# EasyEDA schematic SCH_ESP32_PCB_2026-04-29.json
TITLE: Sheet_1; REV: 1.0; Date: 2026-04-29; Sheet: 1/1; Drawn By: nare.manukian222; Company: Your Company
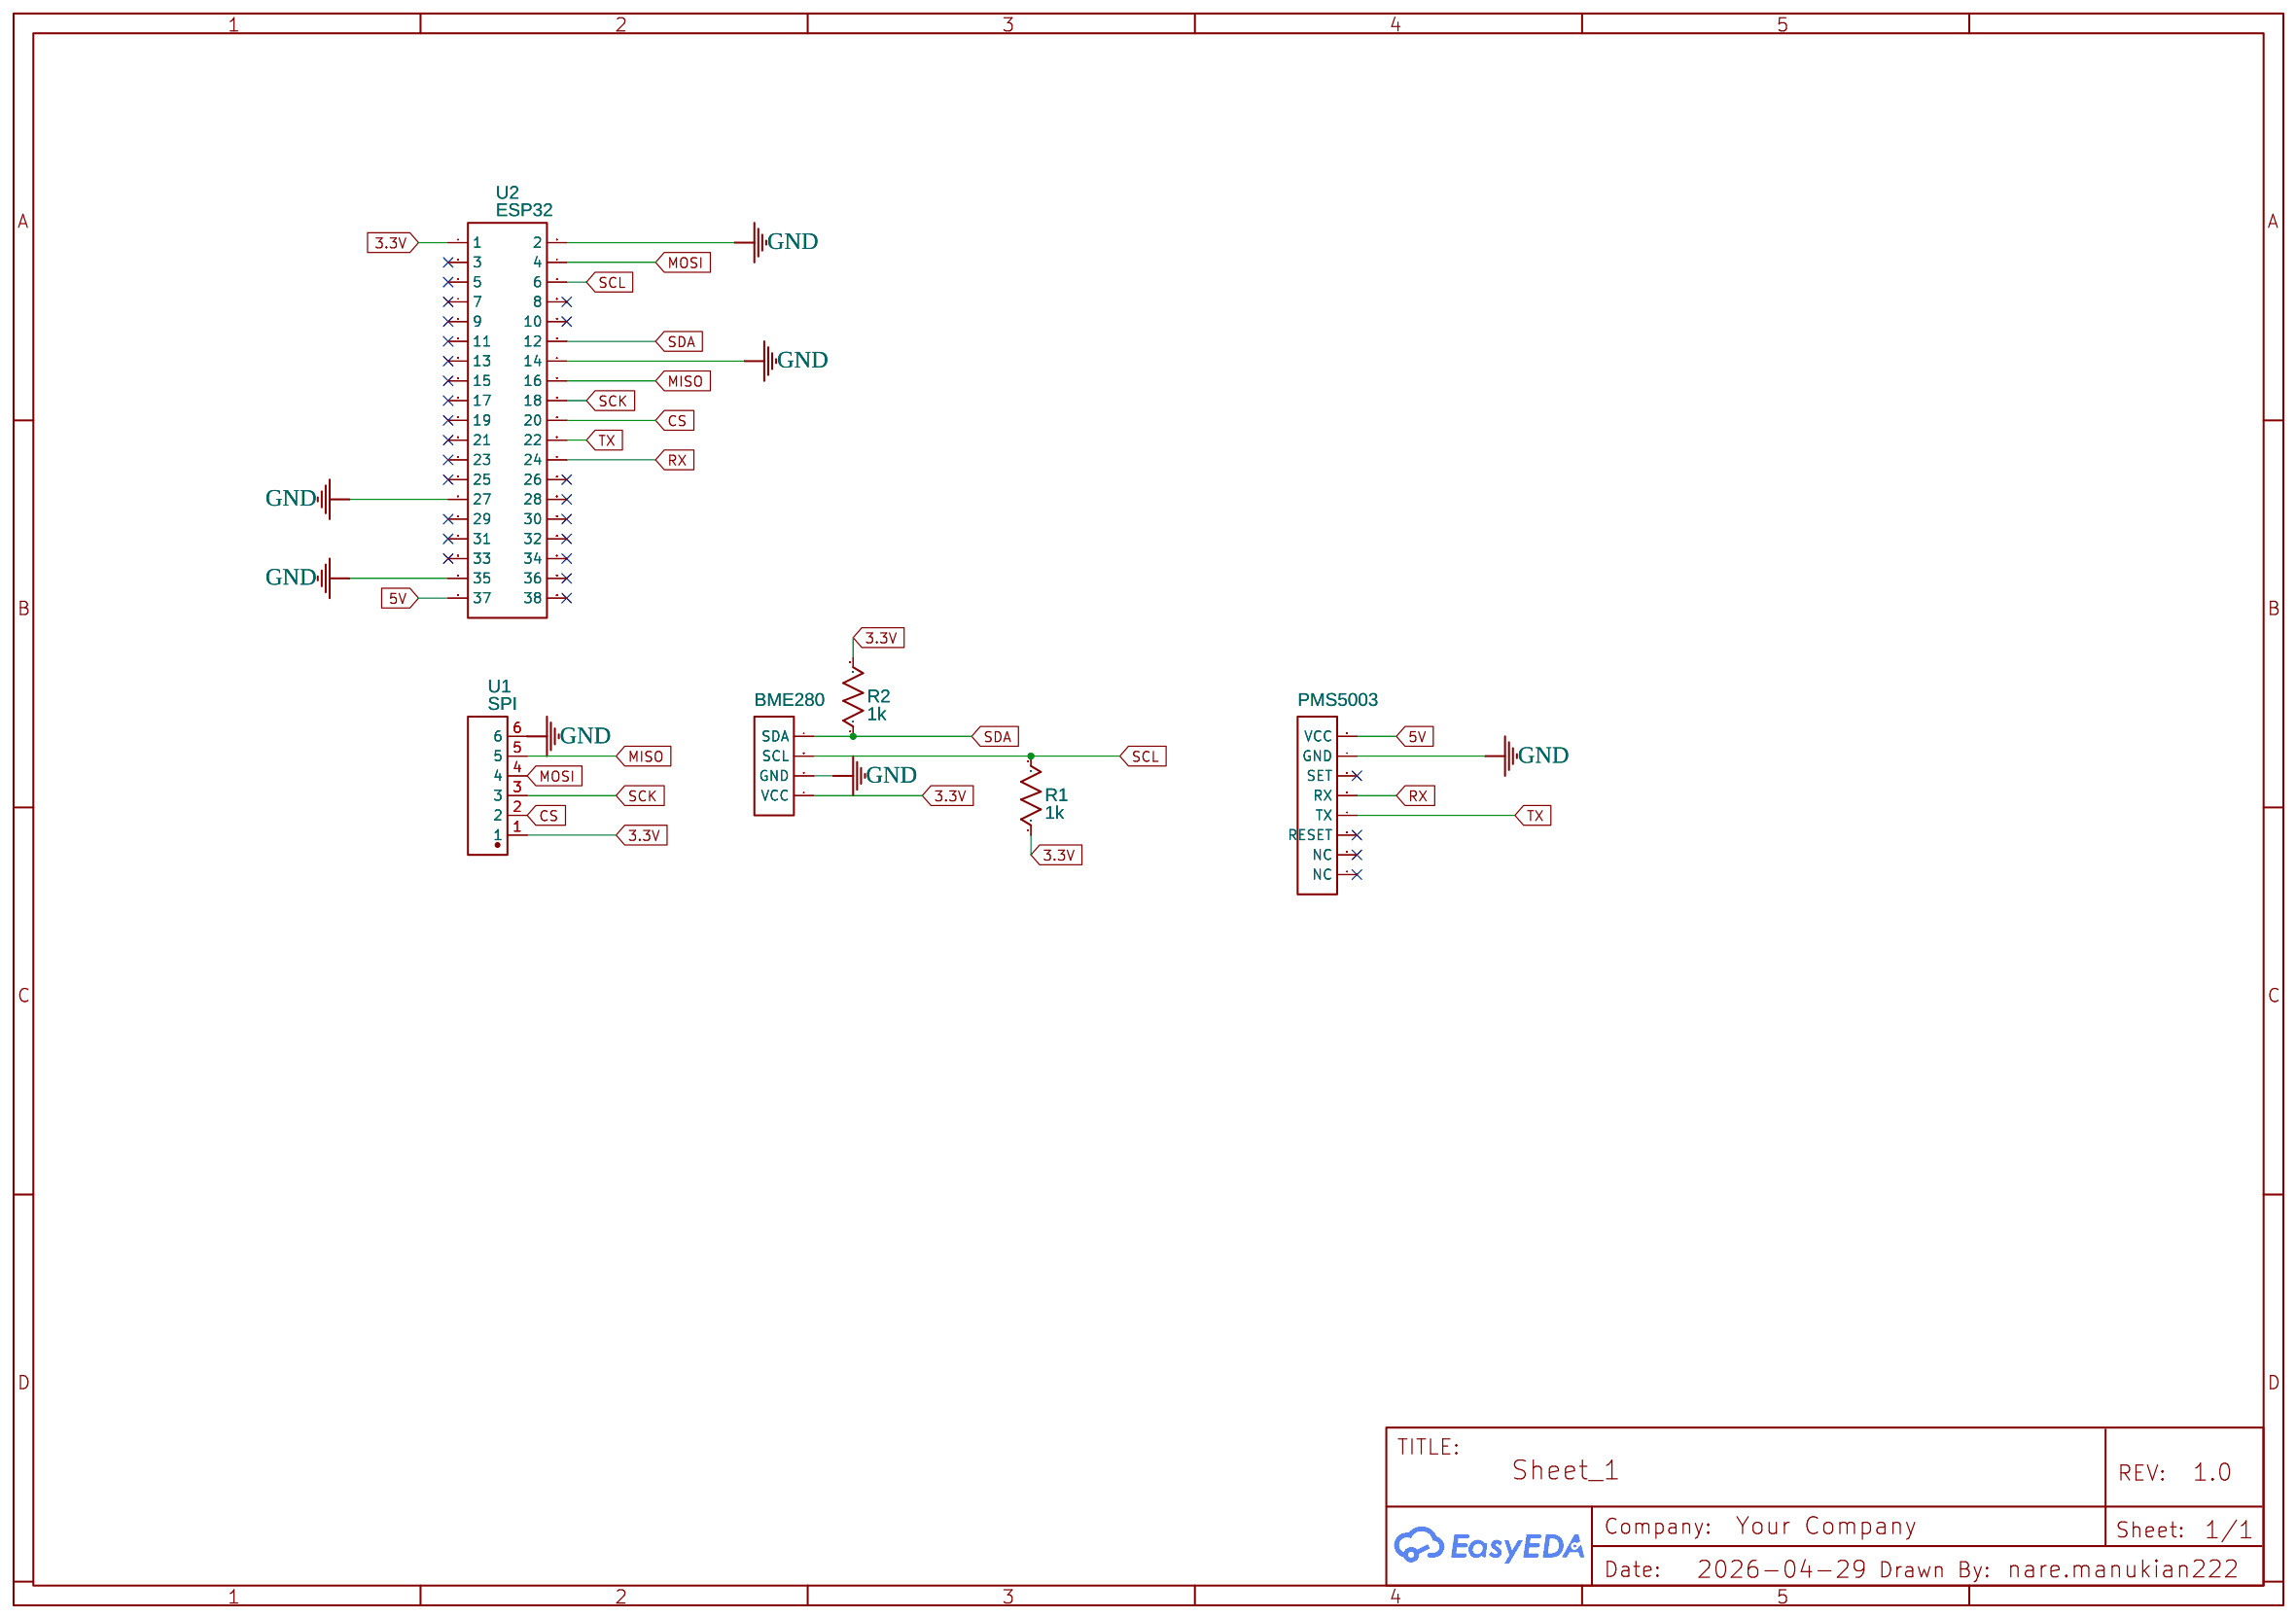
[diagram p0: schematic sheet]

## Parts
H1  BME280  [HDR-F-2.54_1X4]
H2  PMS5003  [HDR-F-2.54_1X8]
R1  1k  [R_AXIAL-0.4]
R2  1k  [R_AXIAL-0.4]
U1  SPI  [HDR-TH_HX-PM2.0-1X6P-WC]
U2  ESP32  [HDR-F-2.54_2X19]

## Library data of the parts
H1 = HDR-F-2.54_1x4: Supplier Part: C225501; Supplier: LCSC; Contributor: BESTPHOTO
H2 = HDR-F-2.54_1x8: Supplier Part: C225505; Supplier: LCSC; Contributor: danil31072003
R1 R2 = R_AXIAL-0.4_US: Contributor: LCEDA_Lib
U1 = HX PM2.0-1X6P WC: Supplier: LCSC; Supplier Part: C22465680; Manufacturer: hanxia(韩下); Manufacturer Part: HX PM2.0-1x6P WC; JLCPCB Part Class: Extended Part; Contributor: lcsc
U2 = HDR-F-2.54_2x19: Contributor: gzbl

## Nets
3.3V: H1.1(VCC) R1.1 R2.2 U1.1 U2.1
5V: H2.8(VCC) U2.37
GND: H1.2(GND) H2.7(GND) U1.6 U2.2 U2.14 U2.27 U2.35
CS: U1.2 U2.20
MISO: U1.5 U2.16
MOSI: U1.4 U2.4
RX: H2.5(RX) U2.24
SCK: U1.3 U2.18
SCL: H1.3(SCL) R1.2 U2.6
SDA: H1.4(SDA) R2.1 U2.12
TX: H2.4(TX) U2.22

Not connected (* = marked no-connect by the designer): H2 1(NC)* 2(NC)* 3(RESET)* 6(SET)*; U2 3* 5* 7* 8* 9* 10* 11* 13* 15* 17* 19* 21* 23* 25* 26* 28* 29* 30* 31* 32* 33* 34* 36* 38*
